# Altium schematic sheet VGA.SchDoc
size A4
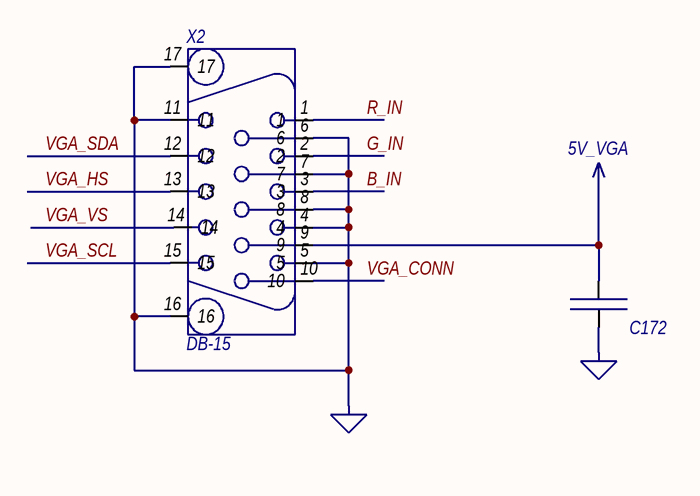
[diagram p0: VGA.SchDoc]

## Parts
C172  Capacitor  [cap_electro_13]  (value not drawn)
X2  DB-15  [VGA]

## Nets
5V_VGA: C172.2 X2.9
GND: C172.1 X2.4 X2.5 X2.6 X2.7 X2.8 X2.11 X2.16 X2.17
B_IN: X2.3
G_IN: X2.2
R_IN: X2.1
VGA_CONN: X2.10
VGA_HS: X2.13
VGA_SCL: X2.15
VGA_SDA: X2.12
VGA_VS: X2.14

## Library data of the parts
X2 = VGA_connector